# Altium schematic sheet CodeSchematic.SchDoc
size A; SheetNumber: 2; SheetTotal: 2
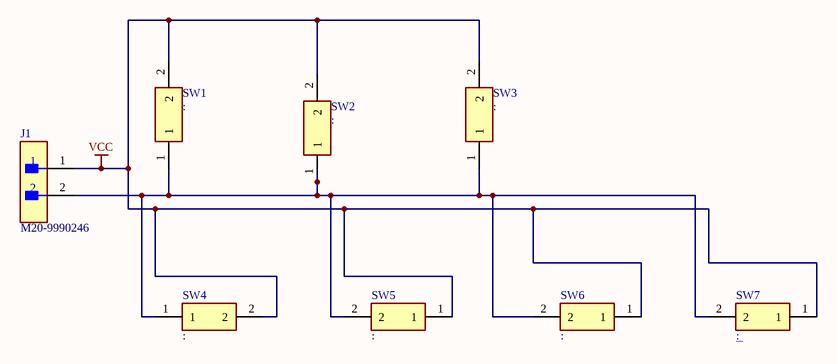
[diagram p0: CodeSchematic.SchDoc]

## Parts
J1  M20-9990246  [FP-M20-9990246-MFG]
SW1  (no value)  [SW_PG151101S11]
SW2  (no value)  [SW_PG151101S11]
SW3  (no value)  [SW_PG151101S11]
SW4  (no value)  [SW_PG151101S11]
SW5  (no value)  [SW_PG151101S11]
SW6  (no value)  [SW_PG151101S11]
SW7  (no value)  [SW_PG151101S11]

## Nets
VCC: J1.1 SW1.2 SW2.2 SW3.2 SW4.2 SW5.1 SW6.1 SW7.1
NetJ1_2: J1.2 SW1.1 SW2.1 SW3.1 SW4.1 SW5.2 SW6.2 SW7.2

## Library data of the parts
J1 = CMP-15831-000009-1: CONN HEADER VERT 2POS 2.54MM; Manufacturer: Harwin; Conn Gender: Male; Conn Orientation: Vertical; Number Of Contacts: 2; Current Rating: 3A; ComponentLink2URL: https://cdn.harwin.com/pdfs/M20-999.pdf; ComponentLink2Description: Datasheet; Package: M20-9990246; Temperature: -40°C to +105°C; Octopart: https://octopart.com/m20-9990246-harwin-2590635; Mouser Description: 2.54mm (0.1") Pitch SIL Vertical PC Tail Pin Header, 6.1mm mating pin height, tin, 2 contacts; Temperature Range High: +105°C; Device Class L1: Connectors; RoHS: TRUE; Automotive: No; Height: 8.99mm; Number Of Rows: 1; Contact Material: Tin,Nickel; Category: Conn; Pitch: 2.54mm; Lead Free: Yes; Digikey Description: CONN HEADER VERT 2POS 2.54MM; Manufacturer Part Number: M20-9990246; Temperature Range Low: -40°C; Device Class L3: unset; Device Class L2: Headers and Wire Housings
SW1-SW7 = PG151101S11: Keyswitch; MF: Kailh; SnapEDA_Link: https://www.snapeda.com/parts/PG151101S11/Kailh/view-part/4218555/?ref=snap; Price: None; MP: PG151101S11; Availability: Unavailable; Value: *; Package: Package